# EAGLE schematic power (EAGLE 7.5.0)
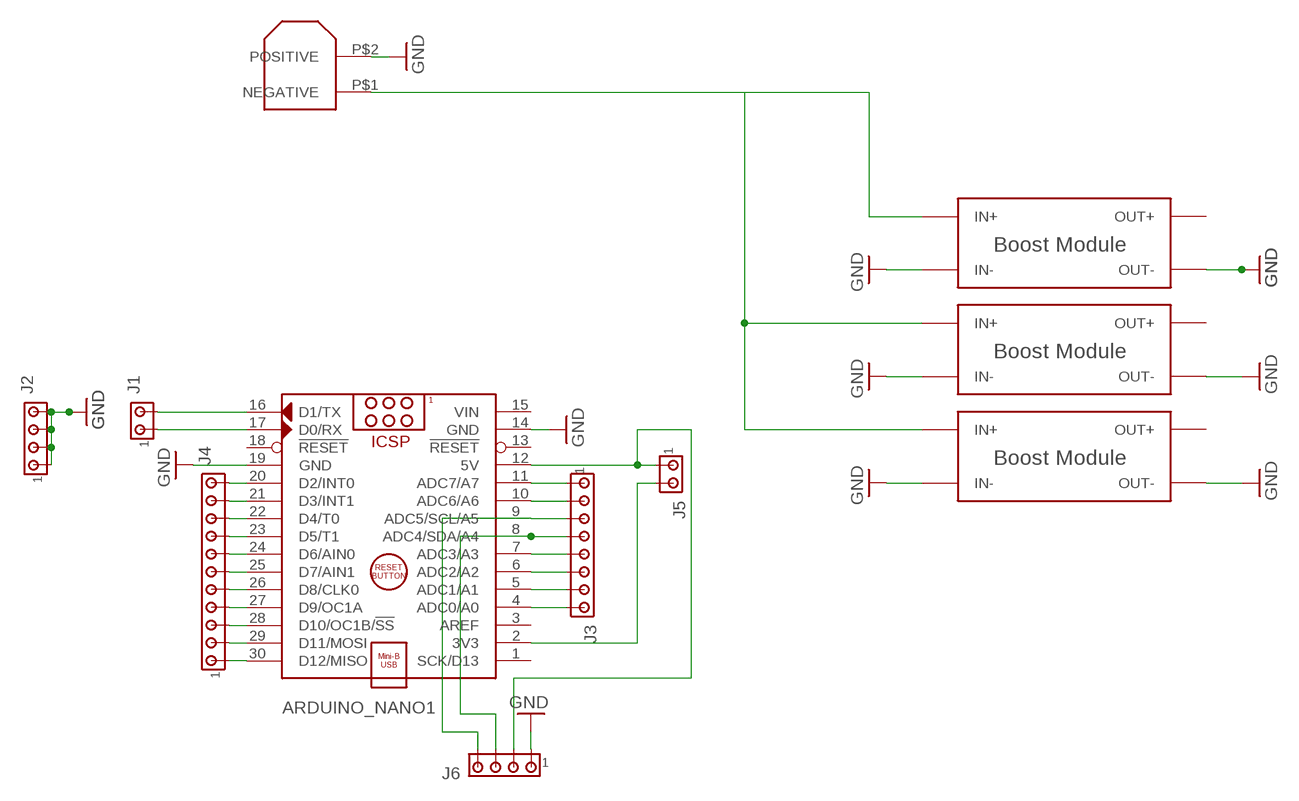
[diagram p0: schematic, sheet 1]

## Parts
ARDUINO_NANO1  ARDUINO_NANO  [ARDUINO_NANO]
J1  MTA02-100  [10X02MTA]
J2  MTA04-100  [10X04MTA]
J3  MTA08-100  [10X08MTA]
J4  MTA11-156  [1X11MTA]
J5  MTA02-100  [10X02MTA]
J6  MTA04-100  [10X04MTA]
U$1  BOOST_MODULE  [BOOST_MODULE]
U$2  BOOST_MODULE  [BOOST_MODULE]
U$3  BOOST_MODULE  [BOOST_MODULE]
U$4  XT60  [CONNECTOR]

## Nets
GND: ARDUINO_NANO1.14(GND) ARDUINO_NANO1.19(GND) J2.1 J2.2 J2.3 J2.4 J6.1 U$1.IN- U$1.OUT- U$2.IN- U$2.OUT- U$3.IN- U$3.OUT- U$4.P$2(POSITIVE)
N$2: U$1.IN+ U$2.IN+ U$3.IN+ U$4.P$1(NEGATIVE)
N$3: ARDUINO_NANO1.16(D1/TX) J1.2
N$4: ARDUINO_NANO1.17(D0/RX) J1.1
N$5: ARDUINO_NANO1.20(D2/INT0) J4.11
N$6: ARDUINO_NANO1.21(D3/INT1) J4.10
N$7: ARDUINO_NANO1.22(D4/T0) J4.9
N$8: ARDUINO_NANO1.23(D5/T1) J4.8
N$9: ARDUINO_NANO1.24(D6/AIN0) J4.7
N$10: ARDUINO_NANO1.25(D7/AIN1) J4.6
N$11: ARDUINO_NANO1.26(D8/CLK0) J4.5
N$12: ARDUINO_NANO1.27(D9/OC1A) J4.4
N$13: ARDUINO_NANO1.28(D10/OC1B/!SS) J4.3
N$14: ARDUINO_NANO1.29(D11/MOSI) J4.2
N$15: ARDUINO_NANO1.30(D12/MISO) J4.1
N$16: ARDUINO_NANO1.11(ADC7/A7) J3.1
N$17: ARDUINO_NANO1.10(ADC6/A6) J3.2
N$18: ARDUINO_NANO1.9(ADC5/SCL/A5) J3.3 J6.4
N$19: ARDUINO_NANO1.8(ADC4/SDA/A4) J3.4 J6.3
N$20: ARDUINO_NANO1.7(ADC3/A3) J3.5
N$21: ARDUINO_NANO1.6(ADC2/A2) J3.6
N$22: ARDUINO_NANO1.5(ADC1/A1) J3.7
N$23: ARDUINO_NANO1.4(ADC0/A0) J3.8
N$24: ARDUINO_NANO1.12(5V) J5.1 J6.2
N$25: ARDUINO_NANO1.2(3V3) J5.2
Unconnected: ARDUINO_NANO1.1(SCK/D13) ARDUINO_NANO1.3(AREF) ARDUINO_NANO1.13(!RESET) ARDUINO_NANO1.18(!RESET) U$1.OUT+ U$2.OUT+ U$3.OUT+

## Power pins joined to a net without a drawn wire
VIN: ARDUINO_NANO1.15(VIN)

## Library data of the parts
ARDUINO_NANO1 = ArduinoNanoV30:ARDUINO_NANO: Arduino Nano V3.0 Module Overview: The Arduino Nano is a small, complete, and breadboard-friendly board based on the ATmega328 (Arduino Nano 3.x) or ATmega168 (Arduino Nano 2.x). It has more or less the same functionality of the Arduino Duemilanove, but in a different package. It lacks only a DC power jack, and works with a Mini-B USB cable instead of a standard one. The Nano was designed and is being produced by Gravitech <http://www.gravitech.us/arna30wiatp.html>. General specifications: Item Value Microcontroller Atmel ATmega168 or ATmega328 Operating Voltage (logic level) 5 V Input Voltage (recommended) 7-12 V Input Voltage (limits) 6-20 V Digital I/O Pins 14 (of which 6 provide PWM output) Analog Input Pins 8 DC Current per I/O Pin 40 mA Flash Memory 16 KB (ATmega168) or 32 KB (ATmega328) of which 2 KB used by bootloader SRAM 1 KB (ATmega168) or 2 KB (ATmega328) EEPROM 512 bytes (ATmega168) or 1 KB (ATmega328) Clock Speed 16 MHz Dimensions (Inches) 0.73" x 1.70" Dimensions (mm) 18mm x 45mm Overall height About 9 mm (not including pins) Weigth 5 g Power: The Arduino Nano can be powered via the Mini-B USB connection, 6-20V unregulated external power supply (pin 30), or 5V regulated external power supply (pin 27). The power source is automatically selected to the highest voltage source. Memory: The ATmega168 has 16 KB of flash memory for storing code (of which 2 KB is used for the bootloader); the ATmega328 has 32 KB, (also with 2 KB used for the bootloader). The ATmega168 has 1 KB of SRAM and 512 bytes of EEPROM (which can be read and written with the EEPROM library); the ATmega328 has 2 KB of SRAM and 1 KB of EEPROM. Input and Output: Each of the 14 digital pins on the Nano can be used as an input or output, using pinMode(), digitalWrite(), and digitalRead() functions. They operate at 5 volts. Each pin can provide or receive a maximum of 40 mA and has an internal pull-up resistor (disconnected by default) of 20-50 kOhms. In addition, some pins have specialized functions. Visit Arduino - ArduinoBoardNano <https://www.arduino.cc/en/Main/ArduinoBoardNano>
J1 J5 = con-amp:MTA02-100: AMP connector
J2 J6 = con-amp:MTA04-100: AMP connector
J3 = con-amp:MTA08-100: AMP connector
J4 = con-amp:MTA11-156: AMP connector
U$1-U$3 = Boost Module:BOOST_MODULE
U$4 = xt60:XT60